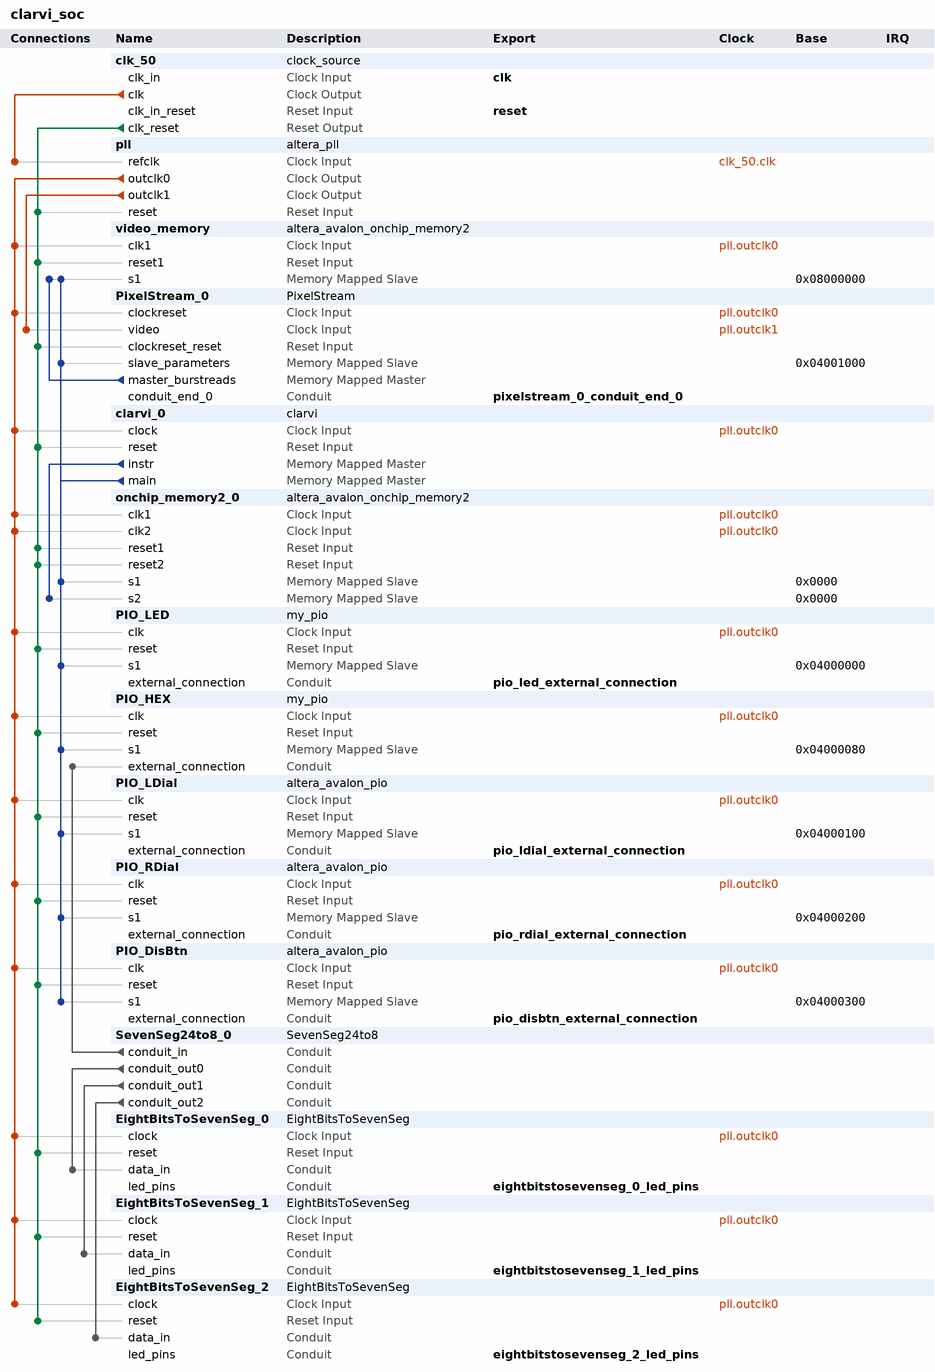
[diagram p0: system contents]
# Platform Designer (Qsys) system clarvi_soc, Cyclone V 5CSEMA5F31C6
# Parameters at their usual value, and those the tool derives, are not listed.
package require -exact qsys 22.1
create_system clarvi_soc
set_project_property DEVICE_FAMILY {Cyclone V}
set_project_property DEVICE 5CSEMA5F31C6

add_instance clk_50 clock_source 22.1
set_instance_parameter_value clk_50 clockFrequency 50000000

add_instance pll altera_pll 22.1
set_instance_parameter_value pll gui_device_speed_grade 2
set_instance_parameter_value pll gui_number_of_clocks 2
set_instance_parameter_value pll gui_operation_mode direct
set_instance_parameter_value pll gui_output_clock_frequency0 50.0
set_instance_parameter_value pll gui_output_clock_frequency1 9.0
set_instance_parameter_value pll gui_pll_mode {Integer-N PLL}
set_instance_parameter_value pll gui_reference_clock_frequency 50.0
set_instance_parameter_value pll gui_use_locked false

add_instance video_memory altera_avalon_onchip_memory2 22.1
set_instance_parameter_value video_memory dataWidth 8
set_instance_parameter_value video_memory dualPort false
set_instance_parameter_value video_memory initMemContent false
set_instance_parameter_value video_memory initializationFileName onchip_mem.hex
set_instance_parameter_value video_memory memorySize 261120

add_instance PixelStream_0 PixelStream 1.0

add_instance clarvi_0 clarvi 1.0
set_instance_parameter_value clarvi_0 DATA_ADDR_WIDTH 62
set_instance_parameter_value clarvi_0 DEFAULT_TRAP_VECTOR 0
set_instance_parameter_value clarvi_0 INITIAL_PC 0
set_instance_parameter_value clarvi_0 INSTR_ADDR_WIDTH 16

add_instance onchip_memory2_0 altera_avalon_onchip_memory2 22.1
set_instance_parameter_value onchip_memory2_0 dataWidth 8
set_instance_parameter_value onchip_memory2_0 dualPort true
set_instance_parameter_value onchip_memory2_0 initMemContent true
set_instance_parameter_value onchip_memory2_0 initializationFileName /home/ben/Project/PartIIProject-Clarvi/software/build/mem8.hex
set_instance_parameter_value onchip_memory2_0 memorySize 65536
set_instance_parameter_value onchip_memory2_0 useNonDefaultInitFile true

add_instance PIO_LED my_pio 1.0
set_instance_parameter_value PIO_LED MEMORY_WIDTH 8
set_instance_parameter_value PIO_LED OUTPUT_WIDTH 10

add_instance PIO_HEX my_pio 1.0
set_instance_parameter_value PIO_HEX MEMORY_WIDTH 8
set_instance_parameter_value PIO_HEX OUTPUT_WIDTH 24

add_instance PIO_LDial altera_avalon_pio 22.1
set_instance_parameter_value PIO_LDial direction Input
set_instance_parameter_value PIO_LDial width 8

add_instance PIO_RDial altera_avalon_pio 22.1
set_instance_parameter_value PIO_RDial direction Input
set_instance_parameter_value PIO_RDial width 8

add_instance PIO_DisBtn altera_avalon_pio 22.1
set_instance_parameter_value PIO_DisBtn direction Input
set_instance_parameter_value PIO_DisBtn width 16

add_instance SevenSeg24to8_0 SevenSeg24to8 1.0

add_instance EightBitsToSevenSeg_0 EightBitsToSevenSeg 1.0

add_instance EightBitsToSevenSeg_1 EightBitsToSevenSeg 1.0

add_instance EightBitsToSevenSeg_2 EightBitsToSevenSeg 1.0

# connections
add_connection clk_50.clk pll.refclk clock
add_connection pll.outclk0 clarvi_0.clock clock
add_connection pll.outclk0 EightBitsToSevenSeg_0.clock clock
add_connection pll.outclk0 EightBitsToSevenSeg_1.clock clock
add_connection pll.outclk0 EightBitsToSevenSeg_2.clock clock
add_connection pll.outclk0 onchip_memory2_0.clk1 clock
add_connection pll.outclk0 onchip_memory2_0.clk2 clock
add_connection pll.outclk0 PIO_DisBtn.clk clock
add_connection pll.outclk0 PIO_HEX.clk clock
add_connection pll.outclk0 PIO_LDial.clk clock
add_connection pll.outclk0 PIO_LED.clk clock
add_connection pll.outclk0 PIO_RDial.clk clock
add_connection pll.outclk0 PixelStream_0.clockreset clock
add_connection pll.outclk0 video_memory.clk1 clock
add_connection pll.outclk1 PixelStream_0.video clock
add_connection clk_50.clk_reset clarvi_0.reset reset
add_connection clk_50.clk_reset EightBitsToSevenSeg_0.reset reset
add_connection clk_50.clk_reset EightBitsToSevenSeg_1.reset reset
add_connection clk_50.clk_reset EightBitsToSevenSeg_2.reset reset
add_connection clk_50.clk_reset onchip_memory2_0.reset1 reset
add_connection clk_50.clk_reset onchip_memory2_0.reset2 reset
add_connection clk_50.clk_reset PIO_DisBtn.reset reset
add_connection clk_50.clk_reset PIO_HEX.reset reset
add_connection clk_50.clk_reset PIO_LDial.reset reset
add_connection clk_50.clk_reset PIO_LED.reset reset
add_connection clk_50.clk_reset PIO_RDial.reset reset
add_connection clk_50.clk_reset PixelStream_0.clockreset_reset reset
add_connection clk_50.clk_reset pll.reset reset
add_connection clk_50.clk_reset video_memory.reset1 reset
add_connection clarvi_0.instr onchip_memory2_0.s2 avalon
set_connection_parameter_value clarvi_0.instr/onchip_memory2_0.s2 baseAddress 0x0000
add_connection clarvi_0.main onchip_memory2_0.s1 avalon
set_connection_parameter_value clarvi_0.main/onchip_memory2_0.s1 baseAddress 0x0000
add_connection clarvi_0.main PIO_DisBtn.s1 avalon
set_connection_parameter_value clarvi_0.main/PIO_DisBtn.s1 baseAddress 0x04000300
add_connection clarvi_0.main PIO_HEX.s1 avalon
set_connection_parameter_value clarvi_0.main/PIO_HEX.s1 baseAddress 0x04000080
add_connection clarvi_0.main PIO_LDial.s1 avalon
set_connection_parameter_value clarvi_0.main/PIO_LDial.s1 baseAddress 0x04000100
add_connection clarvi_0.main PIO_LED.s1 avalon
set_connection_parameter_value clarvi_0.main/PIO_LED.s1 baseAddress 0x04000000
add_connection clarvi_0.main PIO_RDial.s1 avalon
set_connection_parameter_value clarvi_0.main/PIO_RDial.s1 baseAddress 0x04000200
add_connection clarvi_0.main PixelStream_0.slave_parameters avalon
set_connection_parameter_value clarvi_0.main/PixelStream_0.slave_parameters baseAddress 0x04001000
add_connection clarvi_0.main video_memory.s1 avalon
set_connection_parameter_value clarvi_0.main/video_memory.s1 baseAddress 0x08000000
add_connection PixelStream_0.master_burstreads video_memory.s1 avalon
set_connection_parameter_value PixelStream_0.master_burstreads/video_memory.s1 baseAddress 0x08000000
add_connection SevenSeg24to8_0.conduit_in PIO_HEX.external_connection conduit
add_connection SevenSeg24to8_0.conduit_out0 EightBitsToSevenSeg_0.data_in conduit
add_connection SevenSeg24to8_0.conduit_out1 EightBitsToSevenSeg_1.data_in conduit
add_connection SevenSeg24to8_0.conduit_out2 EightBitsToSevenSeg_2.data_in conduit

# exported interfaces
add_interface clk clock sink
set_interface_property clk EXPORT_OF clk_50.clk_in
add_interface eightbitstosevenseg_0_led_pins conduit end
set_interface_property eightbitstosevenseg_0_led_pins EXPORT_OF EightBitsToSevenSeg_0.led_pins
add_interface eightbitstosevenseg_1_led_pins conduit end
set_interface_property eightbitstosevenseg_1_led_pins EXPORT_OF EightBitsToSevenSeg_1.led_pins
add_interface eightbitstosevenseg_2_led_pins conduit end
set_interface_property eightbitstosevenseg_2_led_pins EXPORT_OF EightBitsToSevenSeg_2.led_pins
add_interface pio_disbtn_external_connection conduit end
set_interface_property pio_disbtn_external_connection EXPORT_OF PIO_DisBtn.external_connection
add_interface pio_ldial_external_connection conduit end
set_interface_property pio_ldial_external_connection EXPORT_OF PIO_LDial.external_connection
add_interface pio_led_external_connection conduit end
set_interface_property pio_led_external_connection EXPORT_OF PIO_LED.external_connection
add_interface pio_rdial_external_connection conduit end
set_interface_property pio_rdial_external_connection EXPORT_OF PIO_RDial.external_connection
add_interface pixelstream_0_conduit_end_0 conduit end
set_interface_property pixelstream_0_conduit_end_0 EXPORT_OF PixelStream_0.conduit_end_0
add_interface reset reset sink
set_interface_property reset EXPORT_OF clk_50.clk_in_reset

set_interconnect_requirement {$system} qsys_mm.clockCrossingAdapter HANDSHAKE
set_interconnect_requirement {$system} qsys_mm.enableEccProtection FALSE
set_interconnect_requirement {$system} qsys_mm.insertDefaultSlave FALSE
set_interconnect_requirement {$system} qsys_mm.maxAdditionalLatency 1
set_interconnect_requirement new_target new_requirement_name new_requirement_value
set_interconnect_requirement new_target new_requirement_name_0 new_requirement_value

save_system clarvi_soc.qsys
